# EAGLE design motion (EAGLE 8.2.2)
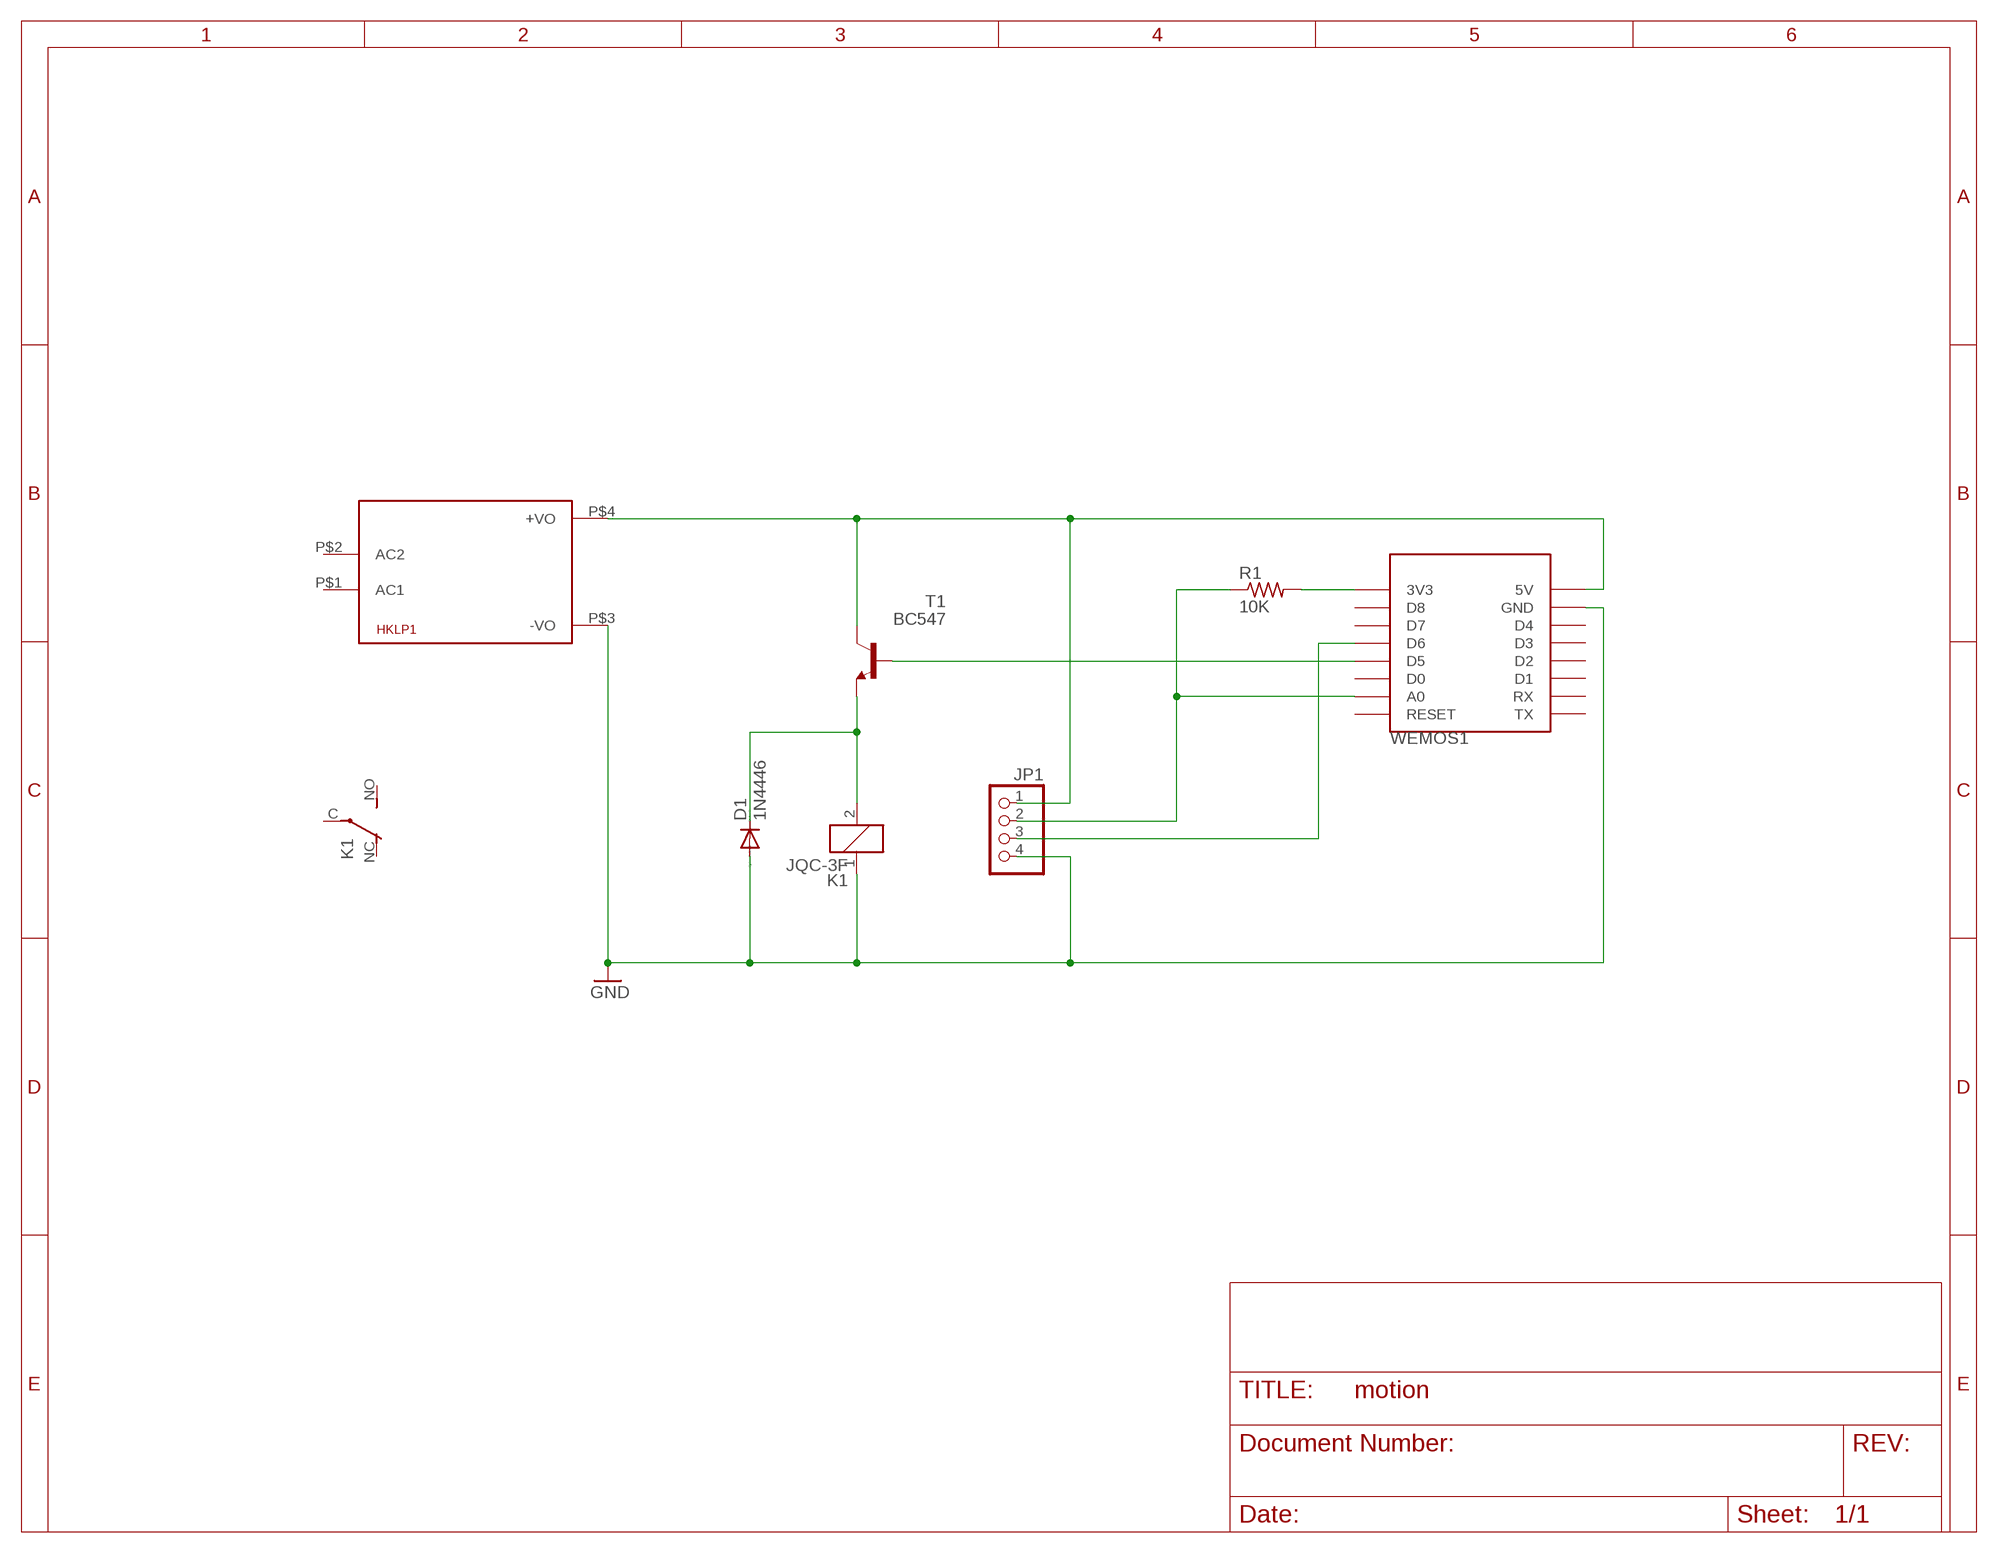
[diagram p0: schematic, sheet 1]

## Parts
D1  1N4446  [DO35-10]
HKLP1  HKLPM01  [HKLPM01]
JP1  PINHD-1X4  [1X04]
K1  JQC-3F  JS-M1-9V-4  [JS-M]
R1  10K  R-US_0309/V  [0309V]
T1  BC547  [TO92]
WEMOS1  WEMOS-D1-MINI  [WEMOS-D1-MINI]

## Nets
GND: D1.A HKLP1.P$3(-VO) JP1.4 K1.1 WEMOS1.GND
N$1: JP1.3 WEMOS1.D6
N$2: JP1.2 R1.1 WEMOS1.A0
N$3: T1.2(B) WEMOS1.D5
N$4: R1.2 WEMOS1.3V3
N$5: HKLP1.P$4(+VO) JP1.1 T1.3(C) WEMOS1.5V
N$7: D1.C K1.2 T1.1(E)
Unconnected: HKLP1.P$1(AC1) HKLP1.P$2(AC2) K1.C(2:P) K1.NC(2:O) K1.NO(2:S) WEMOS1.D0 WEMOS1.D1 WEMOS1.D2 WEMOS1.D3 WEMOS1.D4 WEMOS1.D7 WEMOS1.D8 WEMOS1.RESET WEMOS1.RX WEMOS1.TX

## Library data of the parts
D1 = diode:1N4446: DIODE high speed (Philips)
HKLP1 = HKLPM01:HKLPM01
JP1 = pinhead:PINHD-1X4: PIN HEADER
K1 = relay:JS-M1*: Automotive Ultra-Miniature Power Relay NAiS Source: http://www.mew-europe.com/.. en_ds_61211_0000.pdf; OC_FARNELL: unknown; OC_NEWARK: unknown
R1 = resistor:R-US_: RESISTOR, American symbol
T1 = transistor:BC547: NPN TRANSISTOR
WEMOS1 = esp8266modules:WEMOS-D1-MINI: WeMos.cc D1 mini ESP8266 module

## Board
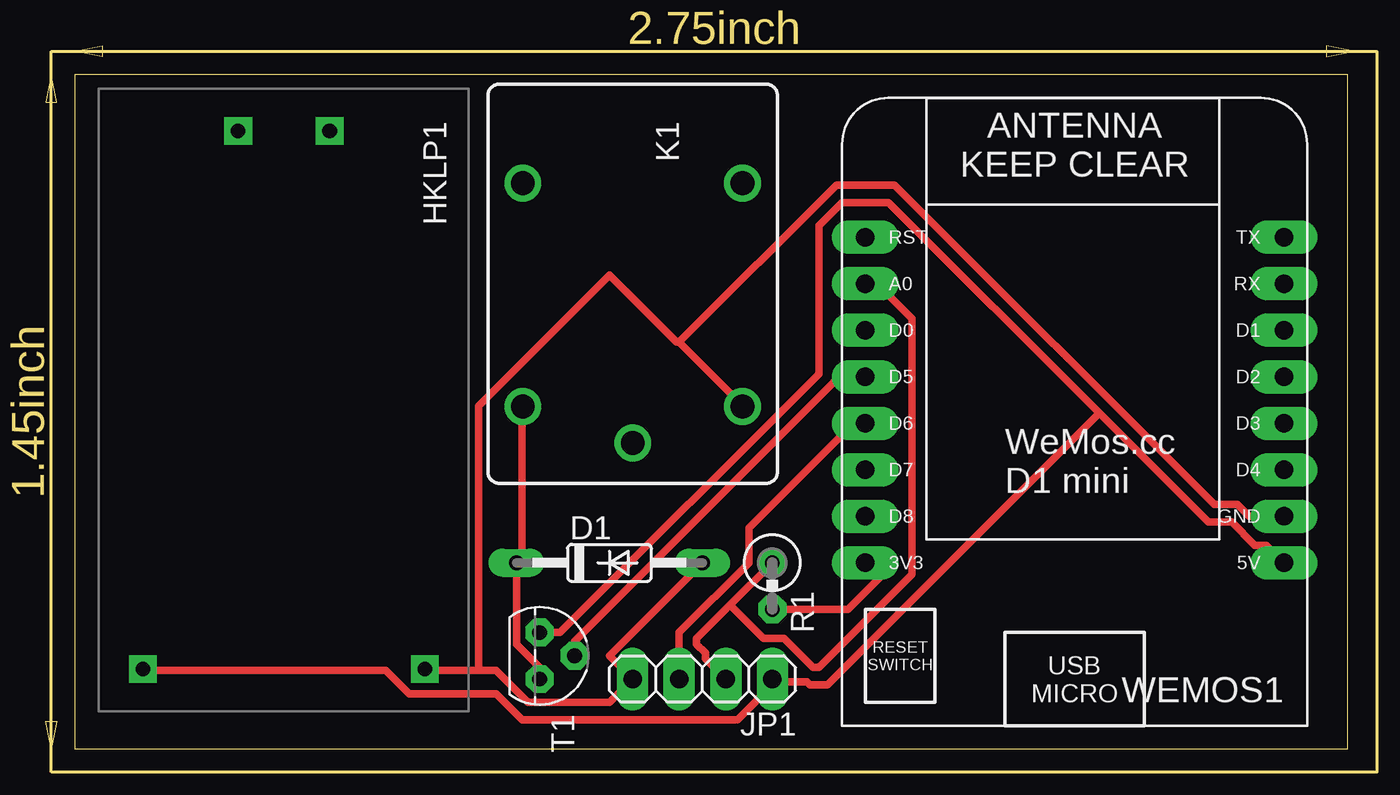
[diagram p1: board, top side]

Size 69.52 x 36.82 mm. Coordinates in mm from the lower left corner, seen from the top.
Outline: 0,0 69.52,0 69.52,36.82 0,36.82 0,0
Copper layers (1*16): Top 0.035mm / dielectric 1.5mm / Bottom 0.035mm
Design rules "default *": minimum track width 16mil, minimum drill 0.35mm, track to track 16mil, track to pad 16mil, pad to pad 16mil, via to via 16mil, smd to smd 6mil, copper to edge 40mil, drill to drill 16mil, minimum pad ring 14mil, minimum via ring 8mil, stop-mask expansion 4mil, vias tented up to drill 0mil, thermal gap 10mil
Milling: 4 lines

### Footprints (pad centres in the part's own frame; a part is rotated, then mirrored left to right if it is on the bottom)
DO35-10 = drill 0.813 long: A 5.08,0; C -5.08,0
HKLPM01 = drill 0.8 square: P$1 -14.7,2.5; P$2 -14.7,-2.5; P$3 14.7,7.7; P$4 14.7,-7.7
1X04 = drill 1.016 long: 1 -3.81,0; 2 -1.27,0; 3 1.27,0; 4 3.81,0
JS-M = drill 1.3: 1 6.7,6; 2 6.7,-6; C 8.7,0; NC -5.5,-6; NO -5.5,6
0309V = drill 0.813 octagon: 1 -1.27,0; 2 1.27,0
TO92 = drill 0.813 octagon: 1 1.27,0; 2 0,1.905; 3 -1.27,0
WEMOS-D1-MINI = drill 1.016 pad 1.829 long: 3V3 -10.16,-10.16; 5V 12.7,-10.16; A0 -10.16,5.08; D0 -10.16,2.54; D1 12.7,2.54; D2 12.7,0; D3 12.7,-2.54; D4 12.7,-5.08; D5 -10.16,0; D6 -10.16,-2.54; D7 -10.16,-5.08; D8 -10.16,-7.62; GND 12.7,-7.62; RESET -10.16,7.62; RX 12.7,5.08; TX 12.7,7.62

### Placement (x,y rotation side)
D1  29.21,10.16 0 top
HKLP1  11.43,19.05 270 top
JP1  34.29,3.81 180 top
K1  30.48,25.4 270 top
R1  38.1,8.89 270 top
T1  25.4,5.08 270 top
WEMOS1  53.34,20.32 0 top

### Tracks (layer width: path | path; a pad name or v marks a point on that pad's centre or on a via)
GND
  Top 0.406: 22.07,4.29 23.02,4.29 24.77,2.54 29.21,2.54 JP1.4 29.21,5.08 D1.A | 22.07,4.29 19.21,4.29 HKLP1.P$3 | WEMOS1.GND 64.14,12.7 63.5,13.34 62.23,13.34 44.77,30.8 41.59,30.8 33.02,22.23 | 33.02,22.23 36.51,18.73 K1.1 | 22.07,4.29 22.07,18.73 29.21,25.88 32.86,22.23 33.02,22.23
N$1
  Top 0.406: JP1.3 33.02,6.35 36.83,10.16 36.83,12.06 42.86,18.1 WEMOS1.D6
N$2
  Top 0.406: 35.8,7.86 33.97,6.03 33.97,5.72 34.45,5.24 34.45,4.92 JP1.2 | 35.8,7.86 R1.1 | WEMOS1.A0 43.81,25.4 45.72,23.49 45.72,9.52 40.64,4.45 40.32,4.45 38.73,6.03 37.62,6.03 35.8,7.86
N$3
  Top 0.406: T1.2 27.3,5.87 42.39,20.96 43.02,20.32 WEMOS1.D5
N$4
  Top 0.406: R1.2 42.23,7.62 43.97,9.37 WEMOS1.3V3
N$5
  Top 0.406: HKLP1.P$4 3.81,4.29 16.99,4.29 18.26,3.02 23.02,3.02 24.45,1.59 36.2,1.59 38.26,3.65 JP1.1 38.42,3.65 40.01,3.65 40.16,3.49 41.12,3.49 55.96,18.34 | T1.3 26.51,6.35 40.64,20.48 40.64,28.57 41.91,29.85 44.45,29.85 55.96,18.34 | 55.96,18.34 61.91,12.38 63.18,12.38 64.45,11.11 65.09,11.11 WEMOS1.5V
N$7
  Top 0.406: T1.1 25.4,4.45 24.13,5.72 D1.C 24.13,10.32 24.45,10.64 24.45,18.57 K1.2

### Text on the board
Document: Antenna | USB